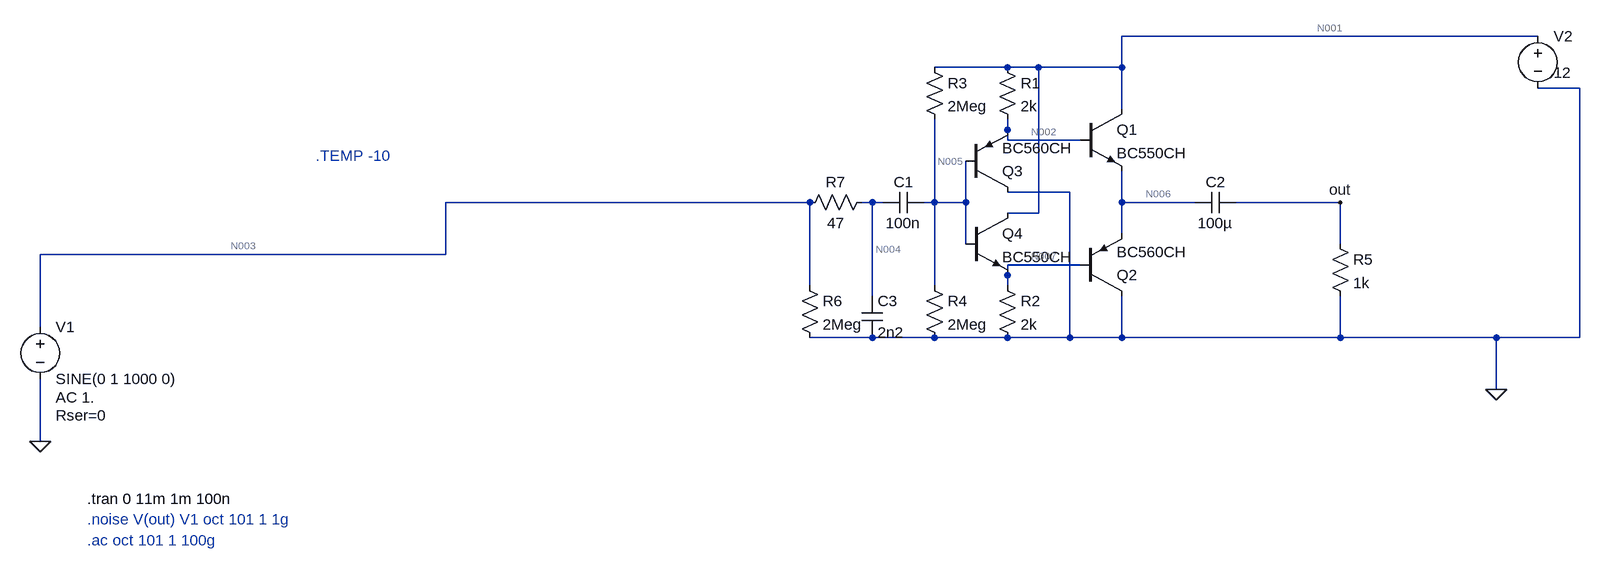
[diagram p0: schematic Diamond buffer.asc]
Diamond buffer.asc, the LTspice schematic file:
Version 4.1
SHEET 1 3660 680
WIRE 2800 -1232 2160 -1232
WIRE 1984 -1184 1872 -1184
WIRE 2032 -1184 1984 -1184
WIRE 2160 -1184 2160 -1232
WIRE 2160 -1184 2032 -1184
WIRE 2864 -1152 2800 -1152
WIRE 2160 -1120 2160 -1184
WIRE 1984 -1088 1984 -1104
WIRE 1984 -1072 1984 -1088
WIRE 2096 -1072 1984 -1072
WIRE 2080 -992 1984 -992
WIRE 1680 -976 1120 -976
WIRE 1776 -976 1760 -976
WIRE 1792 -976 1776 -976
WIRE 1872 -976 1872 -1104
WIRE 1872 -976 1856 -976
WIRE 1920 -976 1920 -1040
WIRE 1920 -976 1872 -976
WIRE 2160 -976 2160 -1024
WIRE 2272 -976 2160 -976
WIRE 2496 -976 2336 -976
WIRE 2032 -960 2032 -1184
WIRE 2032 -960 1984 -960
WIRE 2160 -928 2160 -976
WIRE 1920 -912 1920 -976
WIRE 2496 -912 2496 -976
WIRE 1120 -896 1120 -976
WIRE 1120 -896 496 -896
WIRE 2096 -880 1984 -880
WIRE 1984 -864 1984 -880
WIRE 1680 -848 1680 -976
WIRE 1872 -848 1872 -976
WIRE 1984 -848 1984 -864
WIRE 1776 -832 1776 -976
WIRE 496 -784 496 -896
WIRE 1776 -768 1680 -768
WIRE 1872 -768 1776 -768
WIRE 1984 -768 1872 -768
WIRE 2080 -768 2080 -992
WIRE 2080 -768 1984 -768
WIRE 2160 -768 2160 -832
WIRE 2160 -768 2080 -768
WIRE 2496 -768 2496 -832
WIRE 2496 -768 2160 -768
WIRE 2736 -768 2496 -768
WIRE 2864 -768 2864 -1152
WIRE 2864 -768 2736 -768
WIRE 2736 -688 2736 -768
WIRE 496 -608 496 -704
FLAG 2736 -688 0
FLAG 496 -608 0
FLAG 2496 -976 out
SYMBOL voltage 2800 -1248 R0
WINDOW 123 24 44 Left 2
WINDOW 39 0 0 Left 2
WINDOW 3 24 72 Left 2
SYMATTR Value 12
SYMATTR InstName V2
SYMBOL voltage 496 -800 R0
WINDOW 123 24 124 Left 2
WINDOW 39 24 152 Left 2
SYMATTR Value2 AC 1.
SYMATTR SpiceLine Rser=0
SYMATTR InstName V1
SYMATTR Value SINE(0 1 1000 0)
SYMBOL npn 2096 -1120 R0
SYMATTR InstName Q1
SYMATTR Value BC550CH
SYMBOL lib\\sym\\pnp 2096 -832 M180
SYMATTR InstName Q2
SYMATTR Value BC560CH
SYMBOL res 1968 -1200 R0
SYMATTR InstName R1
SYMATTR Value 2k
SYMBOL res 1968 -864 R0
SYMATTR InstName R2
SYMATTR Value 2k
SYMBOL lib\\sym\\pnp 1920 -992 M180
SYMATTR InstName Q3
SYMATTR Value BC560CH
SYMBOL npn 1920 -960 R0
SYMATTR InstName Q4
SYMATTR Value BC550CH
SYMBOL cap 1856 -992 R90
WINDOW 0 0 32 VBottom 2
WINDOW 3 32 32 VTop 2
SYMATTR InstName C1
SYMATTR Value 100n
SYMBOL res 1856 -1200 R0
SYMATTR InstName R3
SYMATTR Value 2Meg
SYMBOL res 1856 -864 R0
SYMATTR InstName R4
SYMATTR Value 2Meg
SYMBOL cap 2336 -992 R90
WINDOW 0 0 32 VBottom 2
WINDOW 3 32 32 VTop 2
SYMATTR InstName C2
SYMATTR Value 100µ
SYMBOL res 2480 -928 R0
SYMATTR InstName R5
SYMATTR Value 1k
SYMBOL res 1664 -864 R0
SYMATTR InstName R6
SYMATTR Value 2Meg
SYMBOL cap 1760 -832 R0
SYMATTR InstName C3
SYMATTR Value 2n2
SYMBOL res 1776 -992 R90
WINDOW 0 0 56 VBottom 2
WINDOW 3 32 56 VTop 2
SYMATTR InstName R7
SYMATTR Value 47
TEXT 568 -520 Left 2 !.tran 0 11m 1m 100n
TEXT 920 -1048 Left 2 ;.TEMP -10
TEXT 568 -488 Left 2 ;.noise V(out) V1 oct 101 1 1g
TEXT 568 -456 Left 2 ;.ac oct 101 1 100g

The netlist it stands for:
* Diamond buffer.asc
V2 N001 0 12
V1 N003 0 SINE(0 1 1000 0) AC 1. Rser=0
Q1 N001 N002 N006 0 BC550CH
Q2 0 N007 N006 0 BC560CH
R1 N001 N002 2k
R2 N007 0 2k
Q3 0 N005 N002 0 BC560CH
Q4 N001 N005 N007 0 BC550CH
C1 N005 N004 100n
R3 N001 N005 2Meg
R4 N005 0 2Meg
C2 out N006 100µ
R5 out 0 1k
R6 N003 0 2Meg
C3 N004 0 2n2
R7 N004 N003 47
.model NPN NPN
.model PNP PNP
.lib standard.bjt
.tran 0 11m 1m 100n
* .TEMP -10
* .noise V(out) V1 oct 101 1 1g
* .ac oct 101 1 100g
.backanno
.end

* Results of the author's LTspice run, read from the files saved beside the schematic
* Operating Point, zero values left out:
*   V(n006) = 6.287 V
*   V(n007) = 5.551 V
*   V(n001) = 12 V
*   V(n002) = 6.971 V
*   V(n005) = 6.237 V
*   Ic(Q1) = 2.579 mA
*   Ib(Q1) = 3.63 µA
*   Ie(Q1) = -2.583 mA
*   I(R2) = 2.776 mA
*   I(R4) = 3.118 µA
*   I(V2) = -7.864 mA
*   I(R1) = 2.514 mA
*   Ic(Q4) = 2.768 mA
*   Ib(Q4) = 3.798 µA
*   Ie(Q4) = -2.771 mA
*   Ic(Q2) = -2.578 mA
*   Ib(Q2) = -4.226 µA
*   Ie(Q2) = 2.583 mA
*   I(R3) = 2.882 µA
*   Ic(Q3) = -2.507 mA
*   Ib(Q3) = -4.035 µA
*   Ie(Q3) = 2.511 mA
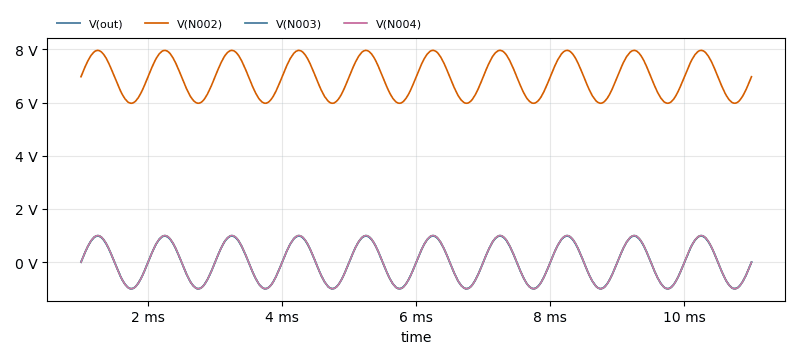
[diagram p1: Transient Analysis of Diamond buffer.asc, plotted from the saved traces]
* Transient Analysis, 1 run:
*   V(out): min -993.3 mV, max 983.3 mV, average -4.964 mV, rms 698.7 mV, last 985 µV
*   V(N002): min 5.973 V, max 7.961 V, average 6.967 V, rms 7.003 V, last 6.972 V
*   V(N003): min -1 V, max 1 V, average 9.464 µV, rms 707.2 mV, last 0 V
*   V(N004): min -999.9 mV, max 999.9 mV, average 9.925 µV, rms 707.1 mV, last -651.9 µV